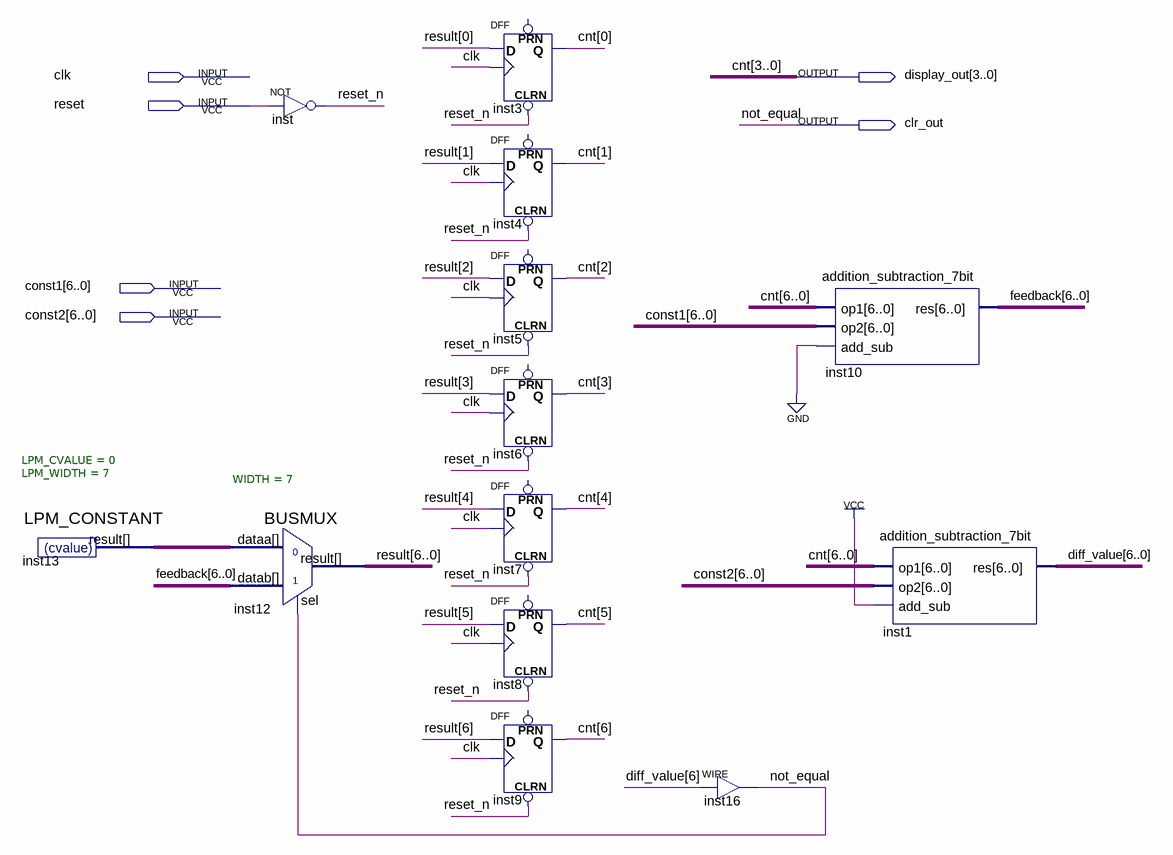
[diagram p0: schematic sheet]
// Quartus schematic counter.bdf as structural Verilog: 13 symbols, 6 pins
module counter (
  input  clk,
  input  reset,
  input  [6:0] const1,
  input  [6:0] const2,
  output [3:0] display_out,
  output clr_out
);

  wire reset_n;
  wire [6:0] diff_value, feedback, inst13_result, result;
  wire [6:4] cnt;

  LPM_CONSTANT #(.LPM_CVALUE(0), .LPM_WIDTH(7)) inst13 (.result(inst13_result));
  not inst (reset_n, reset);
  BUSMUX #(.WIDTH(7)) inst12 (.datab(feedback), .sel(clr_out), .dataa(inst13_result), .result(result));
  DFF inst3 (.CLRN(reset_n), .CLK(clk), .D(result[0]), .Q(display_out[0]));  // open: PRN
  DFF inst4 (.CLRN(reset_n), .CLK(clk), .D(result[1]), .Q(display_out[1]));  // open: PRN
  DFF inst5 (.CLRN(reset_n), .CLK(clk), .D(result[2]), .Q(display_out[2]));  // open: PRN
  DFF inst6 (.CLRN(reset_n), .CLK(clk), .D(result[3]), .Q(display_out[3]));  // open: PRN
  DFF inst7 (.CLRN(reset_n), .CLK(clk), .D(result[4]), .Q(cnt[4]));  // open: PRN
  DFF inst8 (.CLRN(reset_n), .CLK(clk), .D(result[5]), .Q(cnt[5]));  // open: PRN
  DFF inst9 (.CLRN(reset_n), .CLK(clk), .D(result[6]), .Q(cnt[6]));  // open: PRN
  assign clr_out = diff_value[6];  // WIRE inst16
  addition_subtraction_7bit inst10 (.op1({cnt, display_out}), .op2(const1), .add_sub(1'b0), .res(feedback));
  addition_subtraction_7bit inst1 (.op1({cnt, display_out}), .op2(const2), .add_sub(1'b1), .res(diff_value));

  // Other names for the same wires on the sheet: cnt[3:0] = display_out; not_equal = clr_out
endmodule
